# EAGLE design speedy_gonzalez (EAGLE 9.6.2)
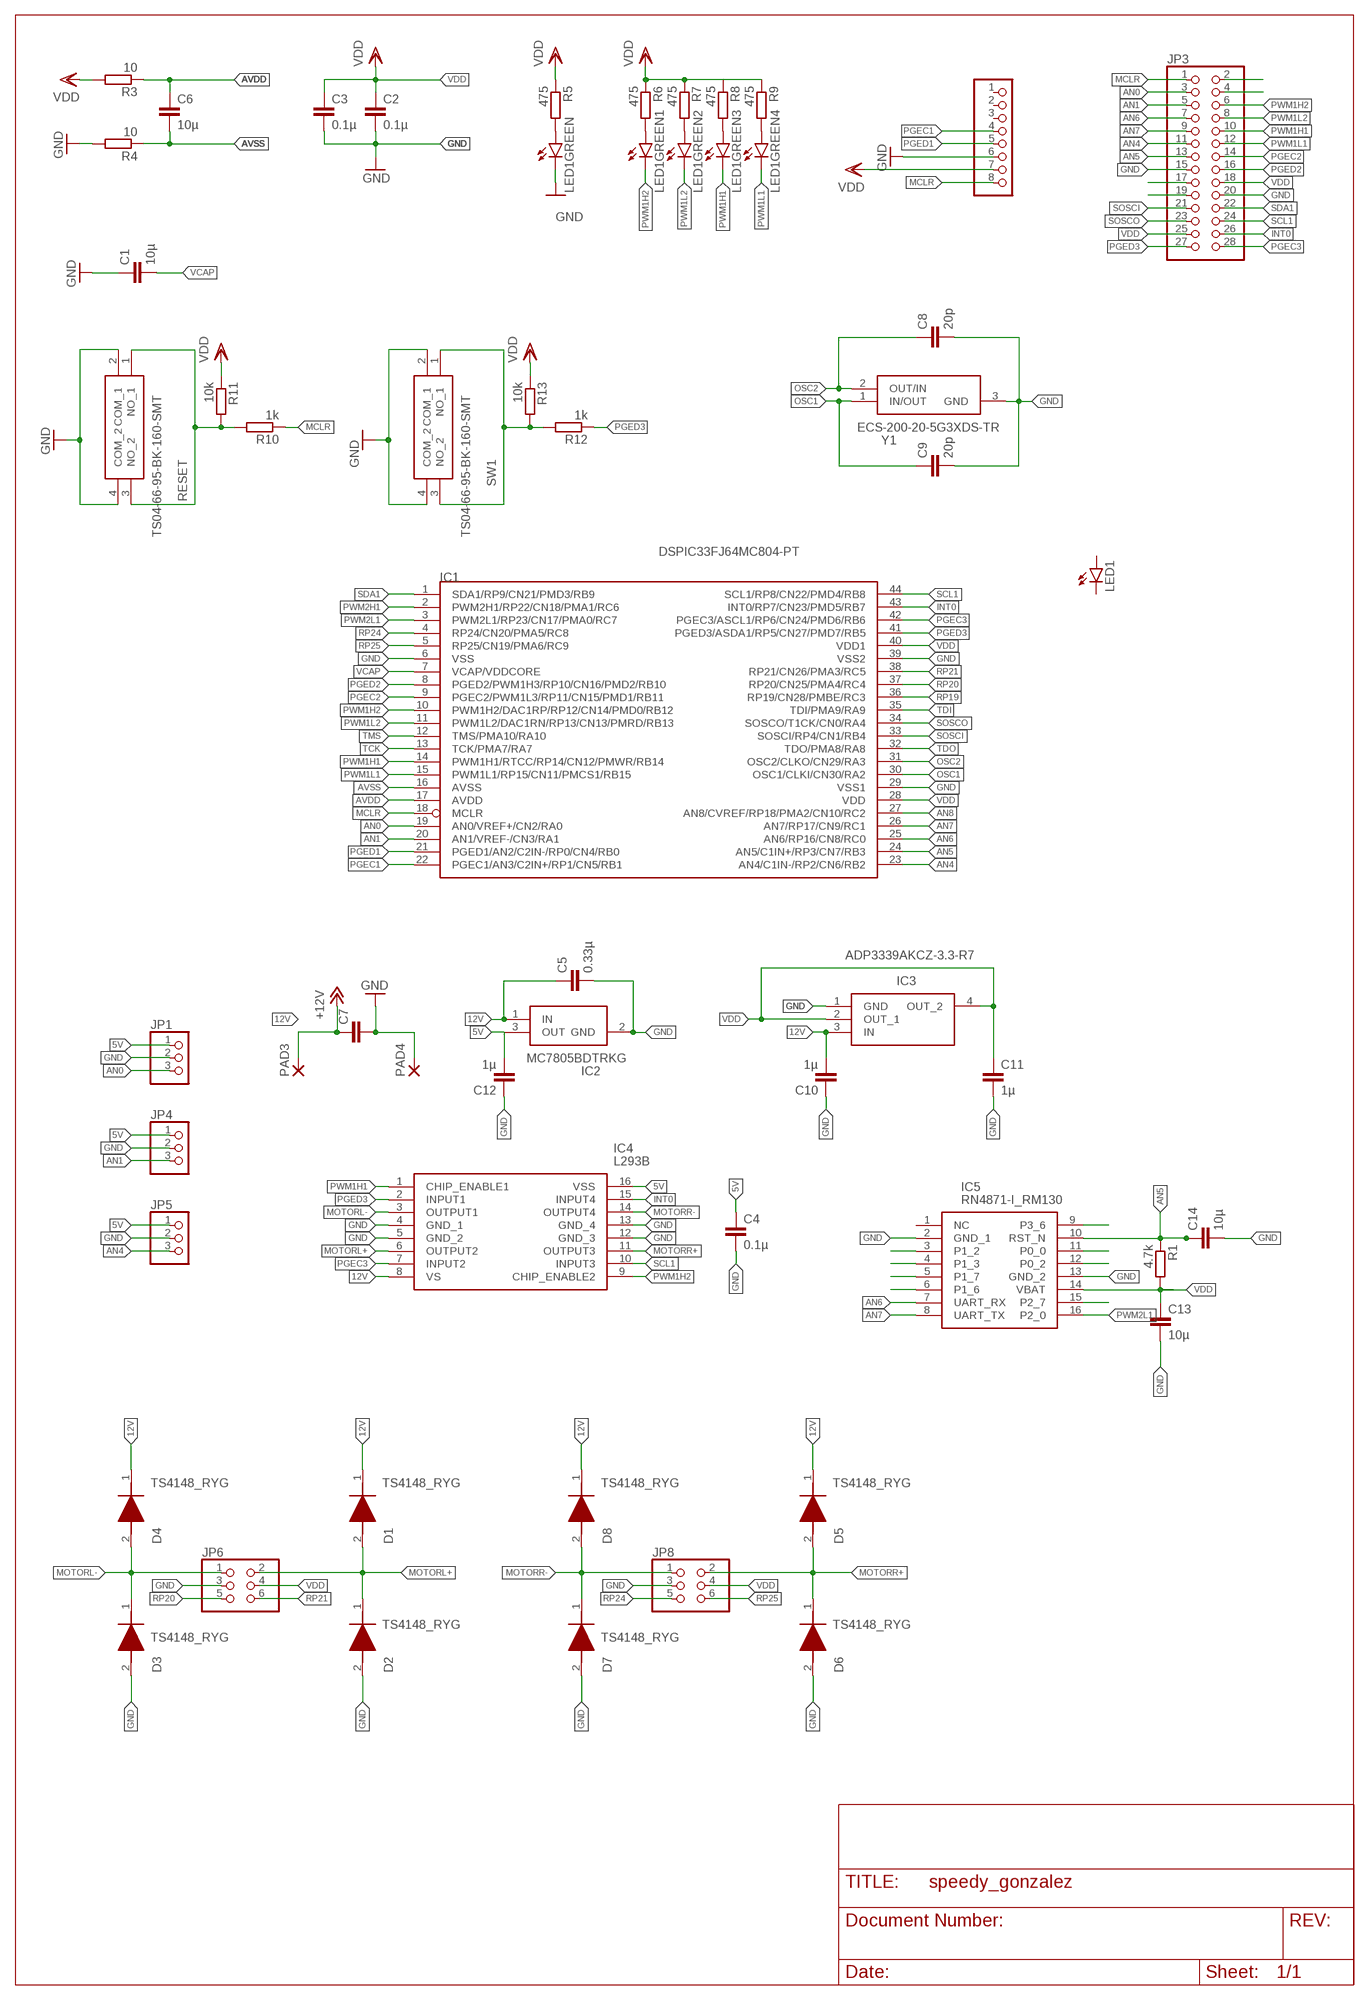
[diagram p0: schematic, sheet 1]

## Parts
C1  10µ  C-EUC0805  [C0805]
C2  0.1µ  C-EUC0805  [C0805]
C3  0.1µ  C-EUC0805  [C0805]
C4  0.1µ  C-EUC0805  [C0805]
C5  0.33µ  C-EUC0805  [C0805]
C6  10µ  C-EUC0805  [C0805]
C7  C-EU050-055X075  [C050-055X075]
C8  20p  C-EUC0805  [C0805]
C9  20p  C-EUC0805  [C0805]
C10  1µ  C-EUC0805  [C0805]
C11  1µ  C-EUC0805  [C0805]
C12  1µ  C-EUC0805  [C0805]
C13  10µ  C-EUC0805  [C0805]
C14  10µ  C-EUC0805  [C0805]
D1  TS4148_RYG  [DIOC2012X85N]
D2  TS4148_RYG  [DIOC2012X85N]
D3  TS4148_RYG  [DIOC2012X85N]
D4  TS4148_RYG  [DIOC2012X85N]
D5  TS4148_RYG  [DIOC2012X85N]
D6  TS4148_RYG  [DIOC2012X85N]
D7  TS4148_RYG  [DIOC2012X85N]
D8  TS4148_RYG  [DIOC2012X85N]
IC1  DSPIC33FJ64MC804-PT  [TQFP44]
IC2  MC7805BDTRKG  [LM317MADTRKG]
IC3  ADP3339AKCZ-3.3-R7  [SOT230P700X180-4N]
IC4  L293B  [DIP850W50P254L2000H510Q16N]
IC5  RN4871-I_RM130  [RN4871]
JP1  PINHD-1X3  [1X03]
JP2  PINHD-1X8  [1X08]
JP3  PINHD-2X14  [2X14]
JP4  PINHD-1X3  [1X03]
JP5  PINHD-1X3  [1X03]
JP6  PINHD-2X3  [2X03]
JP8  PINHD-2X3  [2X03]
LED1  LED5MM  [LED5MM]
LED1GREEN  LEDCHIPLED_0805  [CHIPLED_0805]
LED1GREEN1  LEDCHIPLED_0805  [CHIPLED_0805]
LED1GREEN2  LEDCHIPLED_0805  [CHIPLED_0805]
LED1GREEN3  LEDCHIPLED_0805  [CHIPLED_0805]
LED1GREEN4  LEDCHIPLED_0805  [CHIPLED_0805]
PAD3  2,15/1,0  [2,15/1,0]
PAD4  2,15/1,0  [2,15/1,0]
R1  4.7k  R-EU_R0805  [R0805]
R3  10  R-EU_R0805  [R0805]
R4  10  R-EU_R0805  [R0805]
R5  475  R-EU_R0805  [R0805]
R6  475  R-EU_R0805  [R0805]
R7  475  R-EU_R0805  [R0805]
R8  475  R-EU_R0805  [R0805]
R9  475  R-EU_R0805  [R0805]
R10  1k  R-EU_R0805  [R0805]
R11  10k  R-EU_R0805  [R0805]
R12  1k  R-EU_R0805  [R0805]
R13  10k  R-EU_R0805  [R0805]
RESET  TS04-66-95-BK-160-SMT  [TS046695BK160SMT]
SW1  TS04-66-95-BK-160-SMT  [TS046695BK160SMT]
Y1  ECS-200-20-5G3XDS-TR  [ECS250205G3XDSFTR]

## Nets
5V: C4.1 C12.2 IC2.3(OUT) IC4.16(VSS) JP1.1 JP4.1 JP5.1
12V: C5.1 C7.1 C10.2 D1.1(K) D4.1(K) D5.1(K) D8.1(K) IC2.1(IN) IC3.3(IN) IC4.8(VS) PAD3.1(P) ; supply symbol labelled +12V
AN0: IC1.19(AN0/VREF+/CN2/RA0) JP1.3 JP3.3
AN1: IC1.20(AN1/VREF-/CN3/RA1) JP3.5 JP4.3
AN4: IC1.23(AN4/C1IN-/RP2/CN6/RB2) JP3.11 JP5.3
AN5: C14.1 IC1.24(AN5/C1IN+/RP3/CN7/RB3) IC5.10(RST_N) JP3.13 R1.1
AN6: IC1.25(AN6/RP16/CN8/RC0) IC5.7(UART_RX) JP3.7
AN7: IC1.26(AN7/RP17/CN9/RC1) IC5.8(UART_TX) JP3.9
AN8: IC1.27(AN8/CVREF/RP18/PMA2/CN10/RC2)
AVDD: C6.1 IC1.17(AVDD) R3.1
AVSS: C6.2 IC1.16(AVSS) R4.1
GND: C1.1 C2.2 C3.2 C4.2 C5.2 C7.2 C8.2 C9.2 C10.1 C11.2 C12.1 C13.2 C14.2 D2.2(A) D3.2(A) D6.2(A) D7.2(A) IC1.6(VSS) IC1.29(VSS1) IC1.39(VSS2) IC2.2(GND) IC3.1(GND) IC4.4(GND_1) IC4.5(GND_2) IC4.12(GND_3) IC4.13(GND_4) IC5.2(GND_1) IC5.13(GND_2) JP1.2 JP2.6 JP3.15 JP3.20 JP4.2 JP5.2 JP6.3 JP8.3 LED1GREEN.C PAD4.1(P) R4.2 RESET.2(COM_1) RESET.4(COM_2) SW1.2(COM_1) SW1.4(COM_2) Y1.3(GND)
INT0: IC1.43(INT0/RP7/CN23/PMD5/RB7) IC4.15(INPUT4) JP3.26
MCLR: IC1.18(MCLR) JP2.8 JP3.1 R10.1
MOTORL+: D1.2(A) D2.1(K) IC4.6(OUTPUT2) JP6.2
MOTORL-: D3.1(K) D4.2(A) IC4.3(OUTPUT1) JP6.1
MOTORR+: D5.2(A) D6.1(K) IC4.11(OUTPUT3) JP8.2
MOTORR-: D7.1(K) D8.2(A) IC4.14(OUTPUT4) JP8.1
N$1: LED1GREEN.A R5.2
N$2: LED1GREEN1.A R6.2
N$3: LED1GREEN2.A R7.2
N$6: LED1GREEN3.A R8.2
N$7: R12.2 R13.2 SW1.1(NO_1) SW1.3(NO_2)
N$8: R10.2 R11.2 RESET.1(NO_1) RESET.3(NO_2)
N$10: LED1GREEN4.A R9.2
N$12: IC5.3(P1_2)
N$13: IC5.4(P1_3)
N$14: IC5.5(P1_7)
N$15: IC5.6(P1_6)
N$18: JP3.17
N$19: JP3.19
N$20: IC5.9(P3_6)
N$22: IC5.11(P0_0)
N$23: IC5.12(P0_2)
N$24: JP3.2
N$25: JP3.4
N$28: IC5.15(P2_7)
OSC1: C9.1 IC1.30(OSC1/CLKI/CN30/RA2) Y1.1(IN/OUT)
OSC2: C8.1 IC1.31(OSC2/CLKO/CN29/RA3) Y1.2(OUT/IN)
PGEC1: IC1.22(PGEC1/AN3/C2IN+/RP1/CN5/RB1) JP2.4
PGEC2: IC1.9(PGEC2/PWM1L3/RP11/CN15/PMD1/RB11) JP3.14
PGEC3: IC1.42(PGEC3/ASCL1/RP6/CN24/PMD6/RB6) IC4.7(INPUT2) JP3.28
PGED1: IC1.21(PGED1/AN2/C2IN-/RP0/CN4/RB0) JP2.5
PGED2: IC1.8(PGED2/PWM1H3/RP10/CN16/PMD2/RB10) JP3.16
PGED3: IC1.41(PGED3/ASDA1/RP5/CN27/PMD7/RB5) IC4.2(INPUT1) JP3.27 R12.1
PWM1H1: IC1.14(PWM1H1/RTCC/RP14/CN12/PMWR/RB14) IC4.1(CHIP_ENABLE1) JP3.10 LED1GREEN3.C
PWM1H2: IC1.10(PWM1H2/DAC1RP/RP12/CN14/PMD0/RB12) IC4.9(CHIP_ENABLE2) JP3.6 LED1GREEN1.C
PWM1L1: IC1.15(PWM1L1/RP15/CN11/PMCS1/RB15) JP3.12 LED1GREEN4.C
PWM1L2: IC1.11(PWM1L2/DAC1RN/RP13/CN13/PMRD/RB13) JP3.8 LED1GREEN2.C
PWM2H1: IC1.2(PWM2H1/RP22/CN18/PMA1/RC6)
PWM2L1: IC1.3(PWM2L1/RP23/CN17/PMA0/RC7) IC5.16(P2_0)
RP19: IC1.36(RP19/CN28/PMBE/RC3)
RP20: IC1.37(RP20/CN25/PMA4/RC4) JP6.5
RP21: IC1.38(RP21/CN26/PMA3/RC5) JP6.6
RP24: IC1.4(RP24/CN20/PMA5/RC8) JP8.5
RP25: IC1.5(RP25/CN19/PMA6/RC9) JP8.6
SCL1: IC1.44(SCL1/RP8/CN22/PMD4/RB8) IC4.10(INPUT3) JP3.24
SDA1: IC1.1(SDA1/RP9/CN21/PMD3/RB9) JP3.22
SOSCI: IC1.33(SOSCI/RP4/CN1/RB4) JP3.21
SOSCO: IC1.34(SOSCO/T1CK/CN0/RA4) JP3.23
TCK: IC1.13(TCK/PMA7/RA7)
TDI: IC1.35(TDI/PMA9/RA9)
TDO: IC1.32(TDO/PMA8/RA8)
TMS: IC1.12(TMS/PMA10/RA10)
VCAP: C1.2 IC1.7(VCAP/VDDCORE)
VDD: C2.1 C3.1 C11.1 C13.1 IC1.28(VDD) IC1.40(VDD1) IC3.2(OUT_1) IC3.4(OUT_2) IC5.14(VBAT) JP2.7 JP3.18 JP3.25 JP6.4 JP8.4 R1.2 R3.2 R5.1 R6.1 R7.1 R8.1 R9.1 R11.1 R13.1
Unconnected: IC5.1(NC) JP2.1 JP2.2 JP2.3 LED1.A LED1.K(C)

## Library data of the parts
C1-C14 = rcl:C-EU: CAPACITOR, European symbol; SPICEPREFIX: C
D1-D8 = SamacSys_Parts:TS4148_RYG: TAIWAN SEMICONDUCTOR - TS4148 RYG - DIODE, SMALL SIGNAL, 75V, 0.15A, 0805 Source: Datasheet <https://componentsearchengine.com/Datasheets/2/TS4148 RYG.pdf>; DESCRIPTION: TAIWAN SEMICONDUCTOR - TS4148 RYG - DIODE, SMALL SIGNAL, 75V, 0.15A, 0805; HEIGHT: 0.85mm; MANUFACTURER_NAME: Taiwan Semiconductor; MANUFACTURER_PART_NUMBER: TS4148 RYG; MOUSER_PART_NUMBER: 821-TS4148RYG; MOUSER_PRICE-STOCK: https://www.mouser.co.uk/ProductDetail/Taiwan-Semiconductor/TS4148-RYG?qs=C%2F0tY%2F%2FqZe%2Fr0HVt0T5xsg%3D%3D
IC1 = microchip-dspic33fjxxmc:DSPIC33FJ64MC804: dsPIC33FJ32MC302/304, dsPIC33FJ64MCX02/X04, AND dsPIC33FJ128MCX02/X04 High-Performance, 16-bit Digital Signal Controllers Package:44 Pin TQFP Operating Range: * Up to 40 MIPS operation (at 3.0V -3.6V): - Industrial temperature range (-40°C to +85°C) - Extended temperature range (-40°C to +125°C) High-Performance DSC CPU: * Modified Harvard architecture * C compiler optimized instruction set * 16-bit wide data path * 24-bit wide instructions * Linear program memory addressing up to 4M instruction words * Linear data memory addressing up to 64 Kbytes * 83 base instructions: mostly 1 word/1 cycle * Two 40-bit accumulators with rounding and saturation options * Flexible and powerful addressing modes: - Indirect - Modulo - Bit-Reversed * Software stack * 16 x 16 fractional/integer multiply operations * 32/16 and 16/16 divide operations * Single-cycle multiply and accumulate: - Accumulator write back for DSP operations - Dual data fetch * Up to ±16-bit shifts for up to 40-bit data Direct Memory Access (DMA): * 8-channel hardware DMA * Up to 2 Kbytes dual ported DMA buffer area (DMA RAM) to store data transferred via DMA: - Allows data transfer between RAM and a peripheral while CPU is executing code (no cycle stealing) * Most peripherals support DMA Timers/Capture/Compare/PWM: * Timer/Counters, up to five 16-bit timers: - Can pair up to make two 32-bit timers - One timer runs as a Real-Time Clock with an external 32.768 kHz oscillator - Programmable prescaler * Input Capture (up to four channels): - Capture on up, down or both edges - 16-bit capture input functions - 4-deep FIFO on each capture * Output Compare (up to four channels): - Single or Dual 16-bit Compare mode - 16-bit Glitchless PWM mode * Hardware Real-Time Clock/Calendar (RTCC): - Provides clock, calendar, and alarm functions Interrupt Controller: * 5-cycle latency * Up to 53 available interrupt sources * Up to three external interrupts * Seven programmable priority levels * Five processor exceptions Digital I/O: * Peripheral pin Select functionality * Up to 35 programmable digital I/O pins * Wake-up/Interrupt-on-Change for up to 31 pins * Output pins can drive from 3.0V to 3.6V * Up to 5V output with open drain configuration * All digital input pins are 5V tolerant * 4 mA sink on all I/O pins On-Chip Flash and SRAM: * Flash program memory (up to 128 Kbytes) * Data SRAM (up to 16 Kbytes) * Boot, Secure, and General Security for program Flash System Management: * Flexible clock options: - External, crystal, resonator, internal RC - Fully integrated Phase-Locked Loop (PLL) - Extremely low jitter PLL * Power-up Timer * Oscillator Start-up Timer/Stabilizer * Watchdog Timer with its own RC oscillator * Fail-Safe Clock Monitor * Reset by multiple sources Power Management: * On-chip 2.5V voltage regulator * Switch between clock sources in real time * Idle, Sleep, and Doze modes with fast wake-up Analog-to-Digital Converters (ADCs): * 10-bit, 1.1 Msps or 12-bit, 500 Ksps conversion: - Two and four simultaneous samples (10-bit ADC) - Up to nine input channels with auto-scanning - Conversion start can be manual or synchronized with one of four trigger sources - Conversion possible in Sleep mode - ±2 LSb max integral nonlinearity - ±1 LSb max differential nonlinearity Audio Digital-to-Analog Converter (DAC): - 16-bit Dual Channel DAC module - 100 Ksps maximum sampling rate - Second-Order Digital Delta-Sigma Modulator Comparator Module: * Two analog comparators with programmable input/output configuration CMOS Flash Technology: * Low-power, high-speed Flash technology * Fully static design * 3.3V (±10%) operating voltage * Industrial and Extended temperature * Low power consumption Motor Control Peripherals: * 6-channel 16-bit Motor Control PWM: - Three duty cycle generators - Independent or Complementary mode - Programmable dead-time and output polarity - Edge-aligned or center-aligned - Manual output override control - One Fault input - Trigger for ADC conversions - PWM frequency for 16-bit resolution (@ 40 MIPS) = 1220 Hz for Edge-Aligned mode, 610 Hz for Center-Aligned mode - PWM frequency for 11-bit resolution (@ 40 MIPS) = 39.1 kHz for Edge-Aligned mode, 19.55 kHz for Center-Aligned mode * 2-channel 16-bit Motor Control PWM: - One duty cycle generator - Independent or Complementary mode - Programmable dead time and output polarity - Edge-aligned or center-aligned - Manual output override control - One Fault input - Trigger for ADC conversions - PWM frequency for 16-bit resolution (@ 40 MIPS) = 1220 Hz for Edge-Aligned mode, 610 Hz for Center-Aligned mode - PWM frequency for 11-bit resolution (@ 40 MIPS) = 39.1 kHz for Edge-Aligned mode, 19.55 kHz for Center-Aligned mode * 2-Quadrature Encoder Interface module: - Phase A, Phase B, and index pulse input - 16-bit up/down position counter - Count direction status - Position Measurement (x2 and x4) mode - Programmable digital noise filters on inputs - Alternate 16-bit Timer/Counter mode - Interrupt on position counter rollover/underflow
IC2 = SamacSys_Parts:MC7805BDTRKG: Linear Voltage Regulators 5V 1A Positive Source: Datasheet <https://componentsearchengine.com/Datasheets/2/MC7805BDTRKG.pdf>; DESCRIPTION: Linear Voltage Regulators 5V 1A Positive; HEIGHT: 2.38mm; MANUFACTURER_NAME: onsemi; MANUFACTURER_PART_NUMBER: MC7805BDTRKG; MOUSER_PART_NUMBER: 863-MC7805BDTRKG; MOUSER_PRICE-STOCK: https://www.mouser.co.uk/ProductDetail/onsemi/MC7805BDTRKG?qs=%252B9%2Fcbd0IE0RVSCV5SBH6%2FA%3D%3D
IC3 = SamacSys_Parts:ADP3339AKCZ-3.3-R7: ADP3339AKCZ-3.3-R7, Low Dropout Voltage Regulator, 1.5A, 3.3 V +/-0.9%, 2.8 6 Vin, 4-Pin SOT-223 Source: Datasheet <http://www.analog.com/static/imported-files/data_sheets/ADP3339.pdf>; DESCRIPTION: ADP3339AKCZ-3.3-R7, Low Dropout Voltage Regulator, 1.5A, 3.3 V +/-0.9%, 2.8 6 Vin, 4-Pin SOT-223; HEIGHT: 1.8mm; MANUFACTURER_NAME: Analog Devices; MANUFACTURER_PART_NUMBER: ADP3339AKCZ-3.3-R7; MOUSER_PART_NUMBER: 584-ADP3339AKCZ3.3R7; MOUSER_PRICE-STOCK: https://www.mouser.co.uk/ProductDetail/Analog-Devices/ADP3339AKCZ-3.3-R7?qs=WIvQP4zGanhoxUECVzDnsA%3D%3D
IC4 = SamacSys_Parts:L293B: L293B, Motor Driver, 4.5 36 V, 16-Pin PDIP Source: Datasheet <http://www.st.com/web/en/resource/technical/document/datasheet/CD00000058.pdf>; DESCRIPTION: L293B, Motor Driver, 4.5 36 V, 16-Pin PDIP; HEIGHT: 5.1mm; MANUFACTURER_NAME: STMicroelectronics; MANUFACTURER_PART_NUMBER: L293B; MOUSER_PART_NUMBER: 511-L293B; MOUSER_PRICE-STOCK: https://www.mouser.co.uk/ProductDetail/STMicroelectronics/L293B?qs=gr8Zi5OG3Mhln2B1GrZirA%3D%3D
IC5 = SamacSys_Parts:RN4871-I_RM130: Bluetooth BLE Module, Shielded, Antenna, Source: Datasheet <http://ww1.microchip.com/downloads/en/DeviceDoc/50002489C.pdf>; DESCRIPTION: Bluetooth BLE Module, Shielded, Antenna,; HEIGHT: mm; MANUFACTURER_NAME: Microchip; MANUFACTURER_PART_NUMBER: RN4871-I/RM130; MOUSER_PART_NUMBER: 579-RN4871IRM130; MOUSER_PRICE-STOCK: https://www.mouser.co.uk/ProductDetail/Microchip-Technology/RN4871-I-RM130?qs=MLItCLRbWswoZsrzvVbGYw%3D%3D
JP1 JP4 JP5 = pinhead:PINHD-1X3: PIN HEADER
JP2 = pinhead:PINHD-1X8: PIN HEADER
JP3 = pinhead:PINHD-2X14: PIN HEADER
JP6 JP8 = pinhead:PINHD-2X3: PIN HEADER
LED1 LED1GREEN LED1GREEN1-LED1GREEN4 = led:LED: LED OSRAM: - CHIPLED LG R971, LG N971, LY N971, LG Q971, LY Q971, LO R971, LY R971 LH N974, LH R974 LS Q976, LO Q976, LY Q976 LO Q996 - Hyper CHIPLED LW Q18S LB Q993, LB Q99A, LB R99A - SideLED LS A670, LO A670, LY A670, LG A670, LP A670 LB A673, LV A673, LT A673, LW A673 LH A674 LY A675 LS A676, LA A676, LO A676, LY A676, LW A676 LS A679, LY A679, LG A679 - Hyper Micro SIDELED® LS Y876, LA Y876, LO Y876, LY Y876 LT Y87S - SmartLED LW L88C, LW L88S LB L89C, LB L89S, LG L890 LS L89K, LO L89K, LY L89K LS L896, LA L896, LO L896, LY L896 - TOPLED LS T670, LO T670, LY T670, LG T670, LP T670 LSG T670, LSP T670, LSY T670, LOP T670, LYG T670 LG T671, LOG T671, LSG T671 LB T673, LV T673, LT T673, LW T673 LH T674 LS T676, LA T676, LO T676, LY T676, LB T676, LH T676, LSB T676, LW T676 LB T67C, LV T67C, LT T67C, LS T67K, LO T67K, LY T67K, LW E67C LS E67B, LA E67B, LO E67B, LY E67B, LB E67C, LV E67C, LT E67C LW T67C LS T679, LY T679, LG T679 LS T770, LO T770, LY T770, LG T770, LP T770 LB T773, LV T773, LT T773, LW T773 LH T774 LS E675, LA E675, LY E675, LS T675 LS T776, LA T776, LO T776, LY T776, LB T776 LHGB T686 LT T68C, LB T68C - Hyper Mini TOPLED® LB M676 - Mini TOPLED Santana® LG M470 LS M47K, LO M47K, LY M47K Source: http://www.osram.convergy.de LUXEON: - LUMILED® LXK2-PW12-R00, LXK2-PW12-S00, LXK2-PW14-U00, LXK2-PW14-V00 LXK2-PM12-R00, LXK2-PM12-S00, LXK2-PM14-U00 LXK2-PE12-Q00, LXK2-PE12-R00, LXK2-PE12-S00, LXK2-PE14-T00, LXK2-PE14-U00 LXK2-PB12-K00, LXK2-PB12-L00, LXK2-PB12-M00, LXK2-PB14-N00, LXK2-PB14-P00, LXK2-PB14-Q00 LXK2-PR12-L00, LXK2-PR12-M00, LXK2-PR14-Q00, LXK2-PR14-R00 LXK2-PD12-Q00, LXK2-PD12-R00, LXK2-PD12-S00 LXK2-PH12-R00, LXK2-PH12-S00 LXK2-PL12-P00, LXK2-PL12-Q00, LXK2-PL12-R00 Source: www.luxeon.com KINGBRIGHT: KA-3528ASYC Source: www.kingbright.com
PAD3 PAD4 = wirepad:2,15/1,0: THROUGH-HOLE PAD
R1 R3-R13 = rcl:R-EU_: RESISTOR, European symbol; SPICEPREFIX: R
RESET SW1 = SamacSys_Parts:TS04-66-95-BK-160-SMT: Switch Tactile OFF (ON) SPST Round Button Gull Wing 0.05A 12VDC 80000Cycles 1.6N SMD Bag Source: Datasheet <https://www.arrow.com/en/products/ts04-66-95-bk-160-smt/cui-devices?region=nac>; DESCRIPTION: Switch Tactile OFF (ON) SPST Round Button Gull Wing 0.05A 12VDC 80000Cycles 1.6N SMD Bag; HEIGHT: 9.6mm; MANUFACTURER_NAME: CUI Inc.; MANUFACTURER_PART_NUMBER: TS04-66-95-BK-160-SMT
Y1 = SamacSys_Parts:ECS-200-20-5G3XDS-TR: Crystals 20.0Mhz 100ppm -40c +125C 20pF Source: Datasheet <https://ecsxtal.com/store/pdf/csm_7x_3l.pdf>; DESCRIPTION: Crystals 20.0Mhz 100ppm -40c +125C 20pF; HEIGHT: 4.2mm; MANUFACTURER_NAME: ECS; MANUFACTURER_PART_NUMBER: ECS-200-20-5G3XDS-TR; MOUSER_PART_NUMBER: 520-ECS-200-20-5GXT; MOUSER_PRICE-STOCK: https://www.mouser.co.uk/ProductDetail/ECS/ECS-200-20-5G3XDS-TR?qs=aTQdX%252BfNGTocHFG2VN%252Birg%3D%3D

## Board
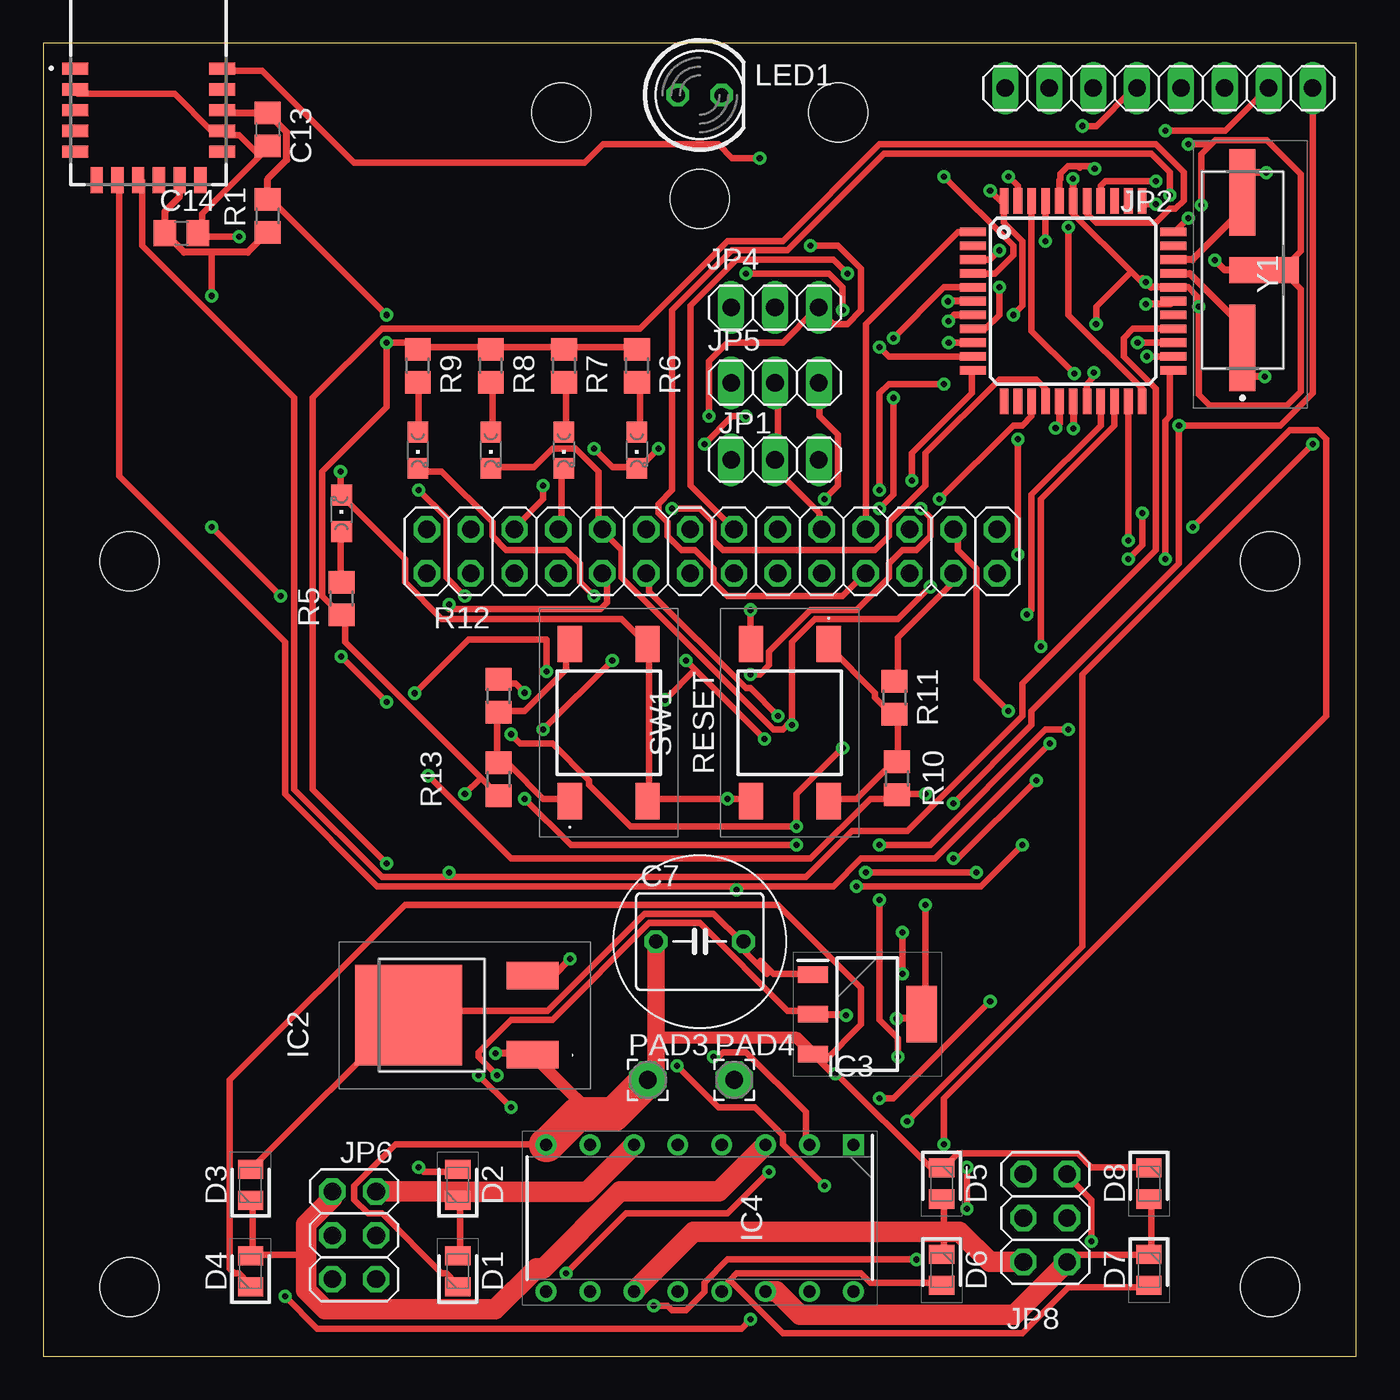
[diagram p1: board, top side]
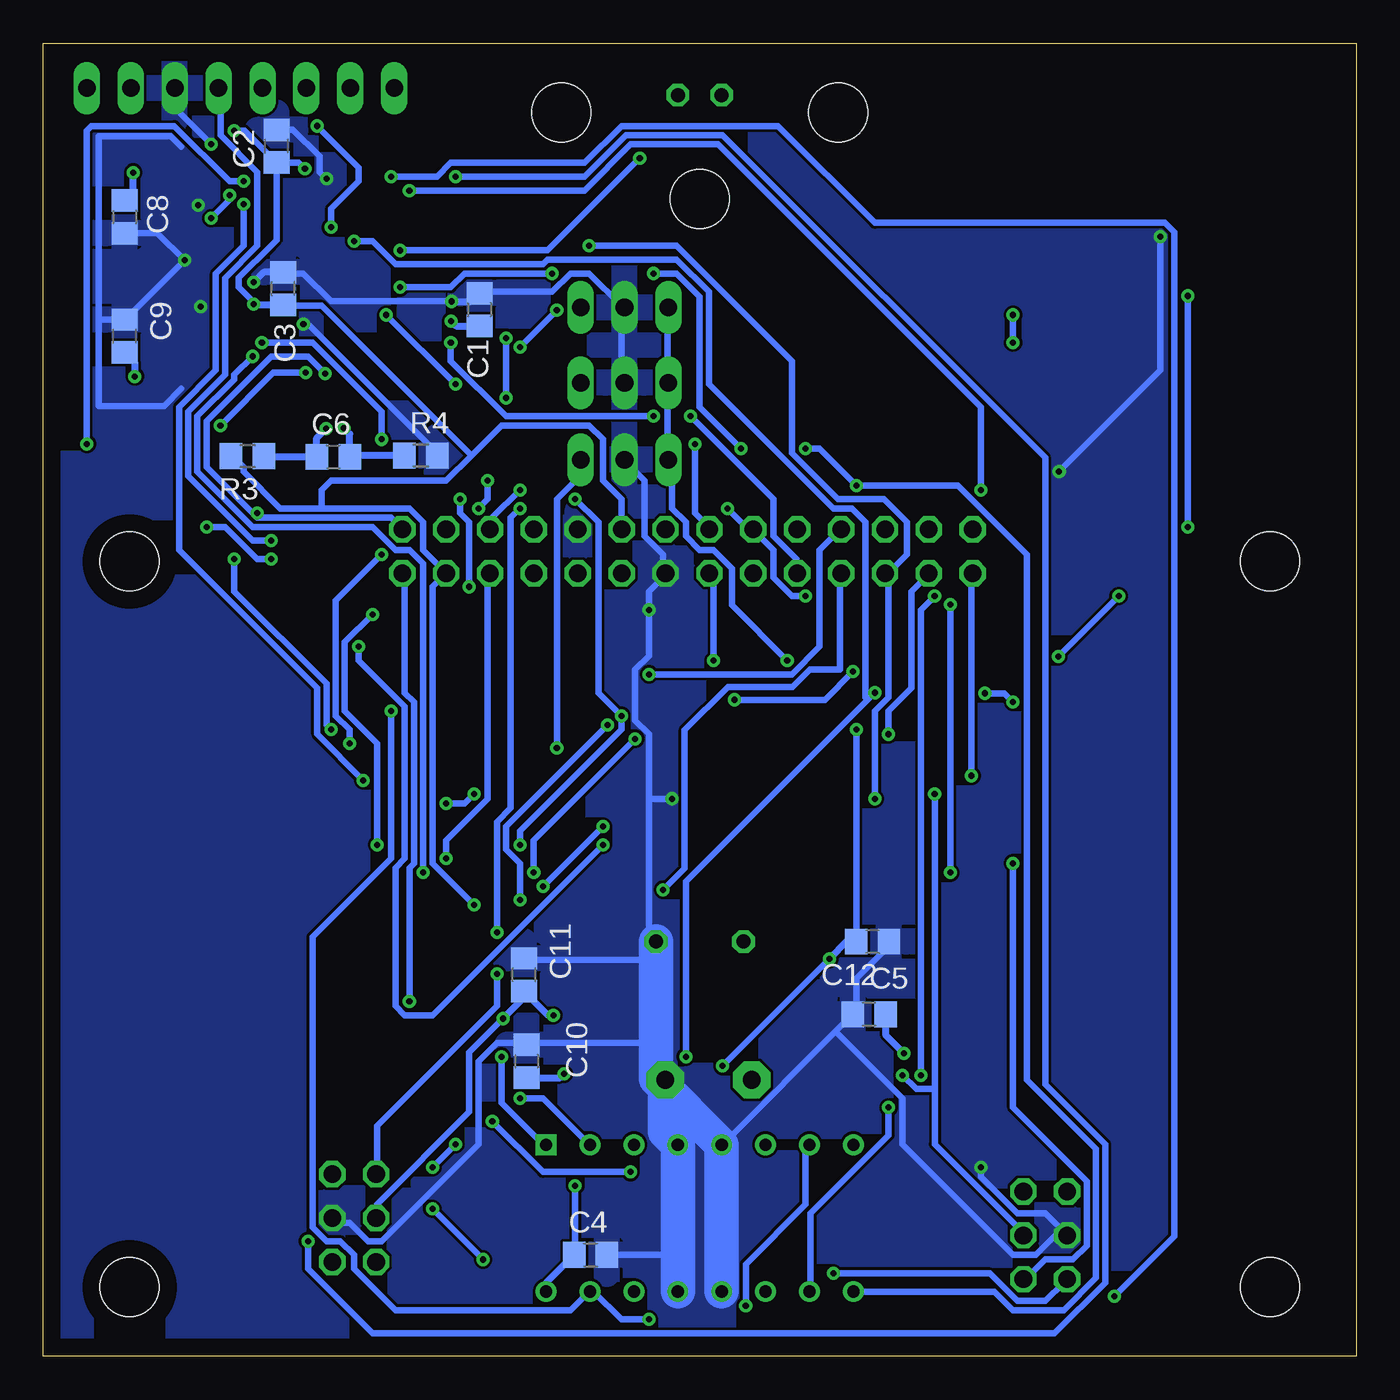
[diagram p2: board, bottom side, seen from below]

Size 76 x 76 mm. Coordinates in mm from the lower left corner, seen from the top.
Outline: 0,0 76,0 76,76 0,76 0,0
Copper layers (1*16): Top 0.035mm / dielectric 1.5mm / Bottom 0.035mm
Design rules "default *": minimum track width 15mil, minimum drill 0.35mm, track to track 6mil, track to pad 6mil, pad to pad 6mil, via to via 6mil, smd to smd 6mil, copper to edge 40mil, drill to drill 6mil, minimum pad ring 10mil, minimum via ring 8mil, stop-mask expansion 4mil, vias tented up to drill 0mil, thermal gap 10mil
Holes 3.4 mm at 5,46 5,4 71,46 71,4 30,72 46,72 38,67

### Footprints (pad centres in the part's own frame; a part is rotated, then mirrored left to right if it is on the bottom)
C0805 = smd 1.3 x 1.5: 1 -0.95,0; 2 0.95,0
C050-055X075 = drill 0.813 octagon: 1 -2.54,0; 2 2.54,0
DIOC2012X85N = smd 1.1 x 1.45: 1 -0.9,0; 2 0.9,0
TQFP44 = smd 1.5 x 0.5: 1 -5.8,4; 2 -5.8,3.2; 3 -5.8,2.4; 4 -5.8,1.6; 5 -5.8,0.8; 6 -5.8,0; 7 -5.8,-0.8; 8 -5.8,-1.6; 9 -5.8,-2.4; 10 -5.8,-3.2; 11 -5.8,-4; 23 5.8,-4; 24 5.8,-3.2; 25 5.8,-2.4; 26 5.8,-1.6; 27 5.8,-0.8; 28 5.8,0; 29 5.8,0.8; 30 5.8,1.6; 31 5.8,2.4; 32 5.8,3.2; 33 5.8,4 | smd 0.5 x 1.5: 12 -4,-5.8; 13 -3.2,-5.8; 14 -2.4,-5.8; 15 -1.6,-5.8; 16 -0.8,-5.8; 17 0,-5.8; 18 0.8,-5.8; 19 1.6,-5.8; 20 2.4,-5.8; 21 3.2,-5.8; 22 4,-5.8; 34 4,5.8; 35 3.2,5.8; 36 2.4,5.8; 37 1.6,5.8; 38 0.8,5.8; 39 0,5.8; 40 -0.8,5.8; 41 -1.6,5.8; 42 -2.4,5.8; 43 -3.2,5.8; 44 -4,5.8
LM317MADTRKG = smd 3 x 1.6: 1 4.08,-2.285; 3 4.08,2.285 | smd 6.2 x 5.8: 2 -3.1,0
SOT230P700X180-4N = smd 1.75 x 0.95: 1 -3.15,2.3; 2 -3.15,0; 3 -3.15,-2.3 | smd 1.75 x 3.25: 4 3.15,0
DIP850W50P254L2000H510Q16N = drill 0.7 pad 1.1 square: 1 -4.25,8.89 | drill 0.7 pad 1.1: 2 -4.25,6.35; 3 -4.25,3.81; 4 -4.25,1.27; 5 -4.25,-1.27; 6 -4.25,-3.81; 7 -4.25,-6.35; 8 -4.25,-8.89; 9 4.25,-8.89; 10 4.25,-6.35; 11 4.25,-3.81; 12 4.25,-1.27; 13 4.25,1.27; 14 4.25,3.81; 15 4.25,6.35; 16 4.25,8.89
RN4871 = smd 1.5 x 0.7: 1 -4.25,6.7; 2 -4.25,5.5; 3 -4.25,4.3; 4 -4.25,3.1; 5 -4.25,1.9; 12 4.25,1.9; 13 4.25,3.1; 14 4.25,4.3; 15 4.25,5.5; 16 4.25,6.7 | smd 0.7 x 1.5: 6 -3,0.25; 7 -1.8,0.25; 8 -0.6,0.25; 9 0.6,0.25; 10 1.8,0.25; 11 3,0.25
1X03 = drill 1.016 long: 1 -2.54,0; 2 0,0; 3 2.54,0
1X08 = drill 1.016 long: 1 -8.89,0; 2 -6.35,0; 3 -3.81,0; 4 -1.27,0; 5 1.27,0; 6 3.81,0; 7 6.35,0; 8 8.89,0
2X14 = drill 1.016 octagon: 1 -16.51,-1.27; 2 -16.51,1.27; 3 -13.97,-1.27; 4 -13.97,1.27; 5 -11.43,-1.27; 6 -11.43,1.27; 7 -8.89,-1.27; 8 -8.89,1.27; 9 -6.35,-1.27; 10 -6.35,1.27; 11 -3.81,-1.27; 12 -3.81,1.27; 13 -1.27,-1.27; 14 -1.27,1.27; 15 1.27,-1.27; 16 1.27,1.27; 17 3.81,-1.27; 18 3.81,1.27; 19 6.35,-1.27; 20 6.35,1.27; 21 8.89,-1.27; 22 8.89,1.27; 23 11.43,-1.27; 24 11.43,1.27; 25 13.97,-1.27; 26 13.97,1.27; 27 16.51,-1.27; 28 16.51,1.27
2X03 = drill 1.016 octagon: 1 -2.54,-1.27; 2 -2.54,1.27; 3 0,-1.27; 4 0,1.27; 5 2.54,-1.27; 6 2.54,1.27
LED5MM = drill 0.813 octagon: A -1.27,0; K 1.27,0
CHIPLED_0805 = smd 1.2 x 1.2: A 0,-1.05; C 0,1.05
2,15/1,0 = drill 1.016 pad 2.159 octagon: 1 0,0
R0805 = smd 1.3 x 1.5: 1 -0.95,0; 2 0.95,0
TS046695BK160SMT = smd 2.1 x 1.4: 1 -4.55,2.25; 2 -4.55,-2.25; 3 4.55,2.25; 4 4.55,-2.25
ECS250205G3XDSFTR = smd 5 x 1.5: 1 -4.5,0; 2 4.5,0 | smd 1.5 x 4: 3 0,-1.25

### Placement (x,y rotation side)
C1  50.75,60.58 270 bottom
C2  62.5,70.04 90 bottom
C3  62.11,61.79 90 bottom
C4  44.32,5.87 0 bottom
C5  28.2,19.8 180 bottom
C6  59.21,52.06 0 bottom
C7  38,24 0 top
C8  71.29,65.95 270 bottom
C9  71.29,59.05 90 bottom
C10  48.03,17.08 270 bottom
C11  48.17,22.08 90 bottom
C12  28,24 180 bottom
C13  13,71 270 top
C14  8,65 0 top
D1  24,4.93 90 top
D2  24,9.93 90 top
D3  12,9.93 90 top
D4  12,4.93 90 top
D5  52,10 270 top
D6  52,5 270 top
D7  64,5 270 top
D8  64,10 270 top
IC1  59.61,61.07 0 top
IC2  24.24,19.74 0 top
IC3  47.7,19.8 0 top
IC4  38,8 270 top
IC5  6.1,67.82 0 top
JP1  42.35,51.89 0 top
JP2  64.58,73.4 0 top
JP3  38.71,46.59 0 top
JP4  42.35,60.7 0 top
JP5  42.35,56.35 0 top
JP6  18,7 270 top
JP8  58,8 90 top
LED1  38,73 0 top
LED1GREEN  17.27,48.79 0 top
LED1GREEN1  34.36,52.44 180 top
LED1GREEN2  30.14,52.44 180 top
LED1GREEN3  25.91,52.44 180 top
LED1GREEN4  21.68,52.44 180 top
PAD3  35,16 0 top
PAD4  40,16 0 top
R1  13,66 90 top
R3  64.17,52.11 180 bottom
R4  54.15,52.13 0 bottom
R5  17.27,43.86 90 top
R6  34.36,57.33 270 top
R7  30.14,57.33 270 top
R8  25.91,57.33 270 top
R9  21.68,57.33 270 top
R10  49.41,33.45 90 top
R11  49.27,38.12 270 top
R12  26.35,38.23 270 top
R13  26.35,33.4 90 top
RESET  43.21,36.67 270 top
SW1  32.73,36.67 90 top
Y1  69.41,62.87 90 top

### Tracks (layer width: path | path; a pad name or v marks a point on that pad's centre or on a via)
5V  (via drill 0.35)
  Top 0.381: v45.21,9.87 42.81,12.27 42.81,12.8 41.2,14.4 39.07,14.4 v36.67,16.8 | v28.94,36.27 v32.94,40.27
  Top 0.4: IC2.3 29.54,22.02 v30.51,22.99
  Bottom 0.381: JP4.1 39.87,60.54 39.87,56.54 JP5.1 39.87,56.27 39.87,52.01 JP1.1 39.6,51.74 39.6,49.07 38.8,48.27 38.8,47.47 38.01,46.67 37.2,46.67 36.14,45.61 36.14,43.47 v32.94,40.27 | v45.21,9.87 45.21,6.13 C4.1 | v36.67,16.8 30.54,22.94 v30.51,22.99 | v28.94,36.27 28.94,24 C12.2
  Bottom 0.4: C12.2 29.5,24 v30.51,22.99 | C4.1 46.89,4.25 IC4.16
12V  (via drill 0.35)
  Top 0.381: D1.1 23.87,4.27 23.34,4.8 23.07,4.8 19.6,8.27 18.8,8.27 18,9.07 18,9.87 20.4,12.27 28.14,12.27 IC4.8 | 30.82,14.95 30.8,14.94 30.92,14.01 | D4.1 11.87,4.27 11.34,4.8 11.07,4.8 10.8,5.07 10.8,16 20.94,26.14 42.54,26.14 47.34,21.34 47.34,19.2 45.21,17.07 IC3.3 | v45.86,16.35 46.01,16.27 51.34,10.94 51.87,10.94 D5.1 52.14,10.94 52.94,11.73 59.87,11.73 60.67,10.94 63.88,10.94 D8.1 | 35.46,18.67 35.6,18.67 35.6,18.42
  Top 0.4: IC2.1 28.24,17.54 v26.18,17.54 | IC3.3 45.7,16.35 v45.86,16.35
  Top 0.7: 31.32,14.46 30.82,14.95 IC2.1 | 35.42,18.42 35.6,18.42 43.63,18.42 IC3.3
  Top 1.016: C7.1 35.46,18.67 35.46,16.46 PAD3.1
  Top 2: PAD3.1 33.01,14.01 30.92,14.01 29.17,12.25 IC4.8
  Bottom 0.4: C5.1 27.25,18.61 v26.18,17.54 | C10.2 46.08,16.13 v45.86,16.35
AN0  (via drill 0.35)
  Top 0.381: v56.94,42.94 57.21,43.2 57.21,49.87 61.21,53.87 61.21,55.21 IC1.19 | v56.67,29.6 54.27,27.2 v47.07,27.2 | v27.07,36.01 27.6,35.47 29.47,35.47 31.6,33.34 31.6,33.07 34.01,30.67 v43.61,30.67 43.61,32.54 v46.27,35.2
  Bottom 0.381: v56.94,42.94 58.54,41.34 58.54,37.34 56.67,35.47 v56.67,29.6 | v43.61,30.67 v47.07,27.2 | v27.07,36.01 27.07,37.34 25.74,38.67 25.74,44.27 24.94,45.07 JP3.3 | v46.27,35.2 46.27,49.61 44.94,50.94 44.94,51.74 JP1.3
AN1  (via drill 0.35)
  Top 0.381: v57.74,41.07 57.74,49.61 62.01,53.87 62.01,55.21 IC1.20 | v43.61,29.6 30.54,29.6 v27.87,32.27 | v38.54,54.41 38.54,57.61 39.6,58.67 42.81,58.67 44.67,60.54 JP4.3 44.94,60.54 45.74,59.74 46.54,59.74 47.34,60.54 47.34,62.94 46.01,64.28 v44.41,64.28
  Bottom 0.381: v57.74,41.07 57.74,40.27 55.07,37.6 55.07,28.8 55.61,28.27 55.61,20.27 55.07,19.74 53.47,19.74 v43.61,29.6 | v27.87,32.27 27.87,37.34 27.07,38.14 27.07,45.07 JP3.5 27.07,45.34 26,46.41 26,48.27 27.34,49.61 30,49.61 32.67,52.27 32.67,57.61 39.34,64.28 v44.41,64.28 | 32.4,45.34 32.4,46.14 33.74,47.47 33.74,49.61 v38.54,54.41
AN4  (via drill 0.35)
  Top 0.381: v64.94,46.14 64.94,54.14 65.21,54.41 65.21,57.07 IC1.23 | v59.34,36.27 58.01,36.27 51.34,29.6 v48.41,29.6 | v42.54,37.07 40.94,38.67 40.67,38.67 35.07,44.27 35.07,45.07 JP3.11 | v45.21,49.61 46.01,50.41 46.01,53.34 44.94,54.41 44.94,56.27 JP5.3
  Bottom 0.381: v64.94,46.14 64.94,44.27 59.61,38.94 59.61,36.54 v59.34,36.27 | v48.41,29.6 48.41,30.4 42.54,36.27 v42.54,37.07 43.87,38.41 43.87,48.27 v45.21,49.61
AN5  (via drill 0.35)
  Top 0.381: v63.88,57.87 65.21,57.87 IC1.24 | v47.61,28 v54.01,28 | v37.2,40.27 37.74,39.74 | 37.74,39.74 v41.74,35.74 | v9.75,61.38 9.75,63.9 | v13.75,44 v9.75,48 | v19.88,37.88 v17.25,40.5 | v21.5,38.38 24.62,41.5 29.12,41.5 v29.12,39.62 | 37.74,39.74 v36,38
  Top 0.4: IC5.10 7.9,67.13 7.05,66.28 C14.1 8.15,63.9 9.75,63.9 11.85,63.9 R1.1
  Bottom 0.381: v63.88,57.87 64.94,56.81 64.94,56.54 67.08,54.41 67.08,51.21 63.88,48.01 56.94,48.01 55.61,46.67 54.81,46.67 54.01,45.87 v54.01,28 | v47.61,28 47.61,29.87 v41.74,35.74 | v37.2,40.27 37.2,45.07 JP3.13 | v9.75,48 v9.75,61.38 | v17.25,40.5 v13.75,44 | v19.88,37.88 20.38,38.38 v21.5,38.38 | v29.12,39.62 30.75,38 v36,38
AN6  (via drill 0.35)
  Top 0.381: 40.12,27.2 45.74,27.2 47.34,28.8 51.61,28.8 v58.27,35.47 | 40.12,27.2 19.34,27.2 14,32.54 14,41.34 4.4,50.94 4.4,68.01 IC5.7 | v56.41,53.07 v56.41,46.41 | v63.34,58.67 65.21,58.67 IC1.25 | 40.12,27.2 v40.12,27
  Bottom 0.381: v58.27,35.47 58.27,36.27 59.07,37.07 59.07,43.74 v56.41,46.41 | v56.41,53.07 56.41,54.67 60.41,58.67 v63.34,58.67 | v40.12,27 38.88,28.25 38.88,36.25 36.38,38.75 32.62,38.75 31.62,39.75 29.88,39.75 29.88,45.25 JP3.7
AN7  (via drill 0.35)
  Top 0.381: 23.5,27.74 19.6,27.74 14.54,32.8 14.54,55.47 5.73,64.28 5.73,68.01 IC5.8 | 23.5,27.74 44.14,27.74 46.81,30.4 50.01,30.4 56.67,37.07 56.67,38.94 64.41,46.67 64.41,56.01 62.54,57.87 62.54,58.94 63.08,59.47 65.21,59.47 IC1.26 | v23.5,43.5 23.5,43.25 32.25,43.25 32.62,43.62 32.62,45 32.38,45.25 JP3.9 | v23.5,28 23.5,27.74
  Bottom 0.381: v23.5,28 v23.5,43.5
AVDD  (via drill 0.35)
  Top 0.4: IC1.17 v59.61,53.7
  Bottom 0.4: v59.61,53.7 60.16,53.16 C6.1 63.17,52.06 R3.1
AVSS  (via drill 0.35)
  Top 0.4: IC1.16 58.81,53.93 v58.6,53.72
  Bottom 0.4: v58.6,53.72 58.26,53.38 C6.2 58.19,52.13 R4.1
GND  (via drill 0.35)
  Top 0.381: v67.02,66.61 67.02,69.57 67.47,70.02 | 67.47,70.02 67.84,70.39 70.82,70.39 72.79,68.42 72.79,63.96 71.7,62.87 | 71.7,62.87 72.79,61.78 72.79,55.84 71.99,55.03 67.51,55.03 66.88,55.66 v66.88,60.74 66.81,60.81 66.81,61.34 66.28,61.87 65.47,61.87 IC1.29 | 71.7,62.87 Y1.3 | IC5.2 2,73.08 7.6,73.08 9.73,70.94 10.27,70.94 IC5.13 10.8,70.67 11.34,70.67 12.4,69.61 C13.2 12.94,69.88 9.2,66.14 9.2,65.08 C14.2 9.2,64.81 v11.34,64.81 | 35.07,32.27 v39.6,32.27 40.94,32.27 RESET.4 | 35.07,32.27 35.07,41.07 SW1.4 34.8,41.34 33.47,42.67 23.07,42.67 20.94,44.81 20.94,46.14 17.47,49.61 LED1GREEN.C 17.2,49.87 v17.2,51.21 | 35.07,32.27 SW1.2 | v40.94,43.2 40.94,41.34 RESET.2 | JP5.2 42.54,56.27 42.54,52.01 JP1.2 42.54,51.74 42.54,51.21 44.94,48.81 44.94,48.01 JP3.20 | v66.28,70.14 67.34,70.14 67.47,70.02 | 62.97,62.77 60.94,60.74 v60.94,59.74 | v63.81,62.17 63.61,62.41 63.47,62.27 62.97,62.77 | 62.97,62.77 59.61,66.14 59.61,66.67 IC1.39 | D3.2 12.13,10.94 20.94,19.74 IC2.2 21.2,20 29.2,20 34.8,25.6 38.8,25.6 40.41,24 C7.2 40.54,23.48 41.9,22.12 41.52,22.89 42.27,22.14 44.41,22.14 IC3.1 | v21.74,10.94 22,10.67 23.87,10.67 D2.2 | 39.74,4.4 39.34,4 IC4.13 | 39.74,4.4 40.14,4.8 47.34,4.8 47.87,4.27 51.87,4.27 D6.2 | 39.74,4.4 42.81,1.33 56.67,1.33 59.34,4 63.88,4 D7.2
  Top 0.4: v59.6,68.16 59.6,66.88 IC1.39 | IC1.29 64.11,61.87 v63.81,62.17 | IC1.6 52.37,61.07 v52.35,61.05 | Y1.3 68.38,62.87 v67.82,63.43 | IC5.2 1.9,73.27 | IC5.13 10.61,70.66
  Bottom 0.381: 68,70 68.62,70.62 72.79,70.62 72.79,60.01 | 72.79,60.01 72.79,55 69,55 68,56 | C8.2 69.39,65 v67.82,63.43 71.25,60 C9.2 71.34,60.01 72.79,60.01 | C2.2 61.56,70.99 59.99,69.45 59.99,68.54 v59.6,68.16 | v11.34,64.81 11.34,57.07 v17.2,51.21 | C1.1 50.54,61.61 46.54,61.61 45.47,62.67 44.41,62.67 42.54,60.81 JP4.2 42.54,60.54 42.54,56.54 JP5.2 | JP1.2 42.27,51.74 41.2,50.67 41.2,47.47 40.14,46.41 40.14,45.34 JP3.15 40.14,45.07 40.94,44.27 v40.94,43.2 40.94,40.54 41.74,39.74 41.74,36.8 40.94,36.01 40.94,32.27 | v66.28,70.14 68.14,72.01 68.14,73.34 JP2.6 | v60.94,59.74 60.67,59.74 53.21,52.27 R4.2 | v52.35,61.05 52.41,61.07 59.34,61.07 60.94,62.67 62.01,62.67 C3.2 | v21.74,10.94 21.74,10.4 19.6,8.27 18,8.27 16.94,7.2 JP6.3 17.2,7.2 18.54,5.87 19.87,5.87 26.27,12.27 26.27,14.94 30.14,18.8 | C12.1 27.07,23.74 28.94,21.87 28.94,20 C5.2 29.2,19.74 30.14,18.8 | 39.27,5.87 43.34,5.87 C4.2 | 40.54,18.14 47.87,18.14 C10.1 48.14,18.14 49.74,18.14 50.81,17.07 50.81,12.27 56.41,6.67 57.21,6.67 58.27,7.73 59.07,7.73 JP8.3 | 40.54,22.94 48.14,22.94 C11.2 | 30.14,18.8 36.14,12.8 IC4.5 | 40.94,32.27 40.94,24.8 C7.2 | 40.94,32.27 v39.6,32.27
  Bottom 0.4: C3.2 63.24,62.74 v63.81,62.17 | v52.35,61.05 51.22,61.05 C1.1
  Bottom 2: IC4.12 IC4.5 40.54,16.06 40.54,16.54 | IC4.13 39.27,5.87 IC4.4 40,12.98 PAD4.1 40.54,16.54 | C7.2 40.54,22.94 40.54,18.14 40.54,16.54
  pour Bottom: -18,43 -18,69 -4,83 94,83 101,76 101,-7 -11,-7 -15,-3 -18,0
INT0  (via drill 0.35)
  Top 0.381: v55.87,68.28 56.41,67.74 56.41,66.94 IC1.43 | v14,3.47 15.87,1.6 40.41,1.6 v40.94,2.13 | v55.87,37.34 54.01,39.2 54.01,45.61 52.94,46.67 52.94,47.74 JP3.26
  Bottom 0.381: v55.87,68.28 53.21,68.28 52.41,69.08 44.67,69.08 42.54,71.21 33.47,71.21 27.87,65.61 11.07,65.61 10.54,65.08 10.54,6.93 v14,3.47 | v40.94,2.13 42.54,2.13 44.14,3.73 IC4.15 44.41,3.73 45.47,2.67 55.61,2.67 58.01,5.07 58.01,5.87 58.81,6.67 59.61,6.67 60.41,7.47 60.41,24.27 55.87,28.8 v55.87,37.34
MCLR  (via drill 0.35)
  Top 0.381: v60.81,56.94 60.81,56.69 60.41,56.28 60.41,55.47 IC1.18 | JP2.8 73.48,73.34 73.48,55.74 71.61,53.87 v65.74,53.87 65.74,45.87 57.21,37.34 57.21,36.54 v52.67,32 | v22.27,33.6 27.07,28.8 44.41,28.8 47.87,32.27 49.21,32.27 R10.1 49.47,32.54 v51.07,32.54
  Bottom 0.381: v60.81,56.94 62.68,56.94 v65.74,53.87 | v22.27,33.6 22.27,45.07 JP3.1 | v52.67,32 51.61,32 v51.07,32.54
MOTORL+
  Top 0.381: D1.2 24.14,5.87 24.14,8.8 D2.1
  Top 0.4: D2.1 24,9.52
  Top 1.2: JP6.2 22.95,9.54 22.96,9.52 24,9.52 31.46,9.52 IC4.6
MOTORL-
  Top 0.381: 15.22,5.87 12.13,5.87 | 12.13,5.87 12.13,8.8 D3.1 | 12.13,5.87 D4.2
  Top 0.4: 16.22,9.03 JP6.1
  Top 1.2: IC4.3 39.1,9.54 33.39,9.54 28.96,5.11 28.55,5.11 26.17,2.72 16.32,2.72 15.22,3.83 15.22,5.87 15.22,7.63 16.73,9.14 JP6.1
MOTORR+
  Top 0.381: D6.1 52.14,6.13 52.14,6.67 52,7.2 52.14,7.73 52.14,9.07 D5.2
  Top 1.2: JP8.2 54.78,5.46 53.04,7.2 52,7.2 37.64,7.2 IC4.11
MOTORR-
  Top 0.381: D8.2 64.14,9.07 64.14,6.13 D7.1 63.88,5.87 59.87,5.87 JP8.1
  Top 0.4: 59.71,5.9 JP8.1
  Top 1.2: IC4.14 42.43,3.75 43.79,2.39 56.2,2.39 JP8.1
N$1
  Top 0.381: LED1GREEN.A 17.2,47.74 17.2,45.07 R5.2
N$2
  Top 0.381: LED1GREEN1.A 34.54,53.61 34.54,56.27 R6.2
N$3
  Top 0.381: LED1GREEN2.A 30.27,53.61 30.27,56.27 R7.2
N$6
  Top 0.381: LED1GREEN3.A 26,53.61 26,56.27 R8.2
N$7
  Top 0.381: SW1.1 30.27,32.27 28.94,32.27 27.07,34.14 26.54,34.14 R13.2 26.27,34.4 26.27,36.8 R12.2 26.54,37.34 27.87,37.34 30.27,39.74 30.27,41.07 SW1.3
  Top 0.4: 26.35,37 R12.2 | SW1.1 30.36,32
N$8
  Top 0.381: RESET.3 45.47,32.27 47.07,32.27 49.21,34.4 R10.2 49.47,34.4 49.47,37.07 R11.2 49.21,37.07 48.14,38.14 48.14,38.41 45.47,41.07 RESET.1
N$10
  Top 0.381: LED1GREEN4.A 21.74,53.61 21.74,56.27 R9.2
OSC1  (via drill 0.35)
  Top 0.381: 69.07,56.93 69.21,57.07 69.21,58.14 Y1.1
  Top 0.4: Y1.1 69.41,59.62 66.36,62.67 IC1.30 | v70.7,56.71 69.29,56.71 69.07,56.93 69,57
  Bottom 0.4: C9.1 70.7,57.51 v70.7,56.71
OSC2  (via drill 0.35)
  Top 0.381: 69.11,68.11 69.21,68.01 69.21,67.47 Y1.2
  Top 0.4: Y1.2 69.41,66.37 66.51,63.47 IC1.31 65,63.47 | v70.79,68.51 69.51,68.51 69.11,68.11 69,68
  Bottom 0.4: C8.1 70.79,67.4 v70.79,68.51
PGEC1  (via drill 0.35)
  Top 0.381: v59.34,65.34 59.34,60.27 63.61,56.01 63.61,55.47 IC1.22 | v60.14,71.21 60.94,71.21 63.08,73.34 JP2.4
  Bottom 0.381: v59.34,65.34 59.34,66.41 57.74,68.01 57.74,68.81 v60.14,71.21
PGEC2  (via drill 0.35)
  Top 0.381: v52.41,58.67 53.74,58.67 IC1.9 | v40.67,54.41 39.87,54.41 v38.27,52.81
  Bottom 0.381: v52.41,58.67 52.41,57.61 49.21,54.41 v40.67,54.41 | v38.27,52.81 38.27,48.81 37.47,48.01 JP3.14
PGEC3  (via drill 0.35)
  Top 0.381: v59.67,56.87 57.21,59.34 57.21,66.67 IC1.42 | v35.34,2.93 36.14,2.93 36.41,2.67 37.2,2.67 38.27,3.73 38.27,4.27 39.6,5.6 v50.54,5.6 | v53.47,10.94 v53.47,8.53 | v52.14,12.27 52.14,14.94 74.28,37.07 74.28,53.07 73.74,53.61 72.14,53.61 v66.54,48.01 | v62.81,46.14 63.61,46.94 v63.61,48.81
  Bottom 0.381: v59.67,56.87 60.67,57.87 62.81,57.87 66.54,54.14 66.54,51.47 63.74,48.67 | 63.74,48.67 63.61,48.54 55.87,48.54 55.34,48.01 JP3.28 | v35.34,2.93 35.34,5.33 31.87,8.8 31.87,12 IC4.7 | v53.47,8.53 v50.54,5.6 | v52.14,12.27 v53.47,10.94 | v66.54,48.01 65.47,48.01 63.61,46.14 v62.81,46.14 | v63.61,48.81 63.74,48.67
PGED1  (via drill 0.35)
  Top 0.381: v62.81,47.21 62.81,55.21 IC1.21
  Bottom 0.381: v62.81,47.21 63.88,47.21 67.61,50.94 67.61,54.67 65.47,56.81 65.47,62.41 63.61,64.28 63.61,68.54 65.74,70.67 65.74,73.34 JP2.5
PGED2  (via drill 0.35)
  Top 0.381: v55.34,61.87 55.34,60.27 54.54,59.47 54.01,59.47 IC1.8 | v46.54,62.67 45.74,63.48 40.14,63.48 37.47,60.81 37.47,50.41 39.87,48.01 JP3.16
  Bottom 0.381: v55.34,61.87 52.41,61.87 51.61,62.67 v46.54,62.67
PGED3  (via drill 0.35)
  Top 0.381: v27.87,38.41 27.34,38.94 26.54,38.94 R12.1 | v38.8,17.34 39.07,17.34 39.34,17.6 40.67,17.6 44.14,14.13 44.14,12.27 IC4.2 | v58.01,64.54 58.01,66.67 IC1.41 | v54.81,20.54 49.21,14.94 v48.41,14.94
  Bottom 0.381: 28.27,38.01 38.8,27.47 v38.8,17.34 | 28.27,38.01 v27.87,38.41 | v58.01,64.54 56.94,64.54 55.61,63.21 47.07,63.21 46.81,63.48 39.34,63.48 37.47,61.61 37.47,56.27 30.27,49.07 29.2,49.07 28.4,48.27 28.4,38.14 28.27,38.01 | v54.81,20.54 54.81,28.27 54.54,28.54 54.54,37.87 55.07,38.41 55.07,45.07 JP3.27 | v48.41,14.94 47.07,14.94 44.41,12.27 IC4.2
PWM1H1  (via drill 0.35)
  Top 0.381: LED1GREEN3.C 26,51.47 28.4,51.47 29.47,52.54 30.8,52.54 32.14,51.21 32.14,48.01 JP3.10 32.4,47.74 33.47,46.67 33.47,45.07 42.27,36.27 42.81,36.27 43.21,36.67 | v51.87,49.61 56.14,53.87 56.67,53.87 57.21,54.41 57.21,55.21 IC1.14 | v51.34,44.54 49.47,42.67 44.67,42.67 43.34,41.34 43.34,36.8 43.21,36.67 | v49.47,17.34 49.47,18.4 48.41,19.47 v48.41,26.4 | v43.34,36.54 43.21,36.67
  Bottom 0.381: v51.87,49.61 51.87,48.81 51.34,48.27 v51.34,44.54 | v49.47,17.34 49.47,14.67 47.07,12.27 IC4.1 | v48.41,26.4 48.41,28.54 49.21,29.34 49.21,30.67 v43.34,36.54
PWM1H2  (via drill 0.35)
  Top 0.381: v31.87,52.54 32.94,51.47 34.27,51.47 LED1GREEN1.C 34.54,51.47 v35.6,52.54 | v28.94,50.41 28.94,49.61 27.34,48.01 JP3.6 | v48.41,58.41 48.94,57.87 53.74,57.87 IC1.10 | v46.27,60.54 46.27,61.87 45.47,62.67 v40.67,62.67
  Bottom 0.381: v31.87,52.54 31.07,52.54 v28.94,50.41 23.07,50.41 19.07,46.41 19.07,16 15.07,12 15.07,4.53 16.94,2.67 19.87,2.67 20.94,3.73 28.94,3.73 IC4.9 | v46.27,60.54 v48.41,58.41 | v40.67,62.67 39.34,62.67 38.01,61.34 38.01,54.94 v35.6,52.54
PWM1L1  (via drill 0.35)
  Top 0.381: v31.87,44.01 31.07,44.81 31.07,45.87 30.27,46.67 26.8,46.67 26,47.47 26,48.27 23.07,51.21 21.74,51.21 LED1GREEN4.C | v36.41,49.07 38.01,49.07 38.8,48.27 38.8,47.21 39.34,46.67 48.14,46.67 48.94,47.47 48.94,48.27 51.07,50.41 51.07,52.27 55.34,56.54 57.47,56.54 58.01,56.01 58.01,55.47 IC1.15
  Bottom 0.381: v31.87,44.01 32.67,44.01 33.74,45.07 33.74,46.67 34.8,47.74 JP3.12 35.07,47.74 v36.41,49.07
PWM1L2  (via drill 0.35)
  Top 0.381: LED1GREEN2.C 30,51.21 30,48.01 JP3.8 | v50.27,50.67 50.27,52.27 53.74,55.74 53.74,56.96 53.81,56.96 IC1.11 | v50.81,49.07 51.34,48.54 51.34,47.47 50.54,46.67 49.74,46.67 48.94,45.87 48.94,45.07 47.07,43.2 44.41,43.2 42.01,40.8 42.01,40.01 41.47,39.47 v40.94,39.47
  Bottom 0.381: v50.27,50.67 50.27,49.61 v50.81,49.07 | v40.94,39.47 32.67,39.47 31.07,41.07 31.07,46.67 30,47.74 JP3.8
PWM2L1  (via drill 0.35)
  Top 0.381: v55.34,64.01 54.81,63.48 54.01,63.48 IC1.3 | v41.47,69.34 39.87,69.34 39.07,70.14 32.4,70.14 31.34,69.08 18,69.08 12.67,74.41 10.54,74.41 IC5.16
  Bottom 0.381: v55.34,64.01 46.81,64.01 v41.47,69.34
RP20  (via drill 0.35)
  Top 0.381: v64.41,68.01 61.48,68.01 61.21,67.74 61.21,66.94 IC1.37 | v73.48,52.81 60.14,39.47 60.14,23.74 v50.01,13.6 | v42.01,10.67 39.6,8.27 33.74,8.27 v30.27,4.8
  Bottom 0.381: v64.41,68.01 65.21,68.01 68.41,71.21 73.21,71.21 73.48,70.94 v73.48,52.81 | v50.01,13.6 47.07,10.67 v42.01,10.67 | v30.27,4.8 21.2,4.8 19.6,3.2 18,3.2 16.94,4.27 JP6.5
RP21  (via drill 0.35)
  Top 0.381: v19.87,28.54 15.6,32.8 15.6,55.47 19.6,59.47 34.54,59.47 39.6,64.54 42.81,64.54 48.41,70.14 64.41,70.14 66.01,68.54 66.01,66.89 65.53,66.41 65.21,66.41 64.41,65.61 60.94,65.61 60.41,66.14 60.41,66.67 IC1.38
  Bottom 0.381: v19.87,28.54 19.87,14.4 15.6,10.13 15.6,6.4 16.4,5.6 18,5.6 19.07,4.53 JP6.6
RP24  (via drill 0.35)
  Top 0.381: v52.14,68.28 56.14,64.28 56.14,63.74 55.07,62.67 54.01,62.67 IC1.4 | v60.67,6.67 60.67,9.07 59.34,10.4 JP8.5
  Bottom 0.381: v52.14,68.28 44.67,68.28 42.27,70.67 36.67,70.67 18,52.01 18,15.73 14.54,12.27 14.54,4.27 17.47,1.33 56.94,1.33 60.67,5.07 v60.67,6.67
RP25  (via drill 0.35)
  Top 0.381: v49.21,58.94 52.14,61.87 53.74,61.87 IC1.5 | v49.21,55.47 49.21,49.87 v48.41,49.07 | v49.74,22.14 v49.74,24.54
  Bottom 0.381: v49.21,55.47 v49.21,58.94 | v48.41,49.07 48.94,48.54 48.94,31.74 49.74,30.94 v49.74,24.54 | v49.74,22.14 49.74,20.27 56.67,13.34 56.67,10.67 JP8.6
SCL1  (via drill 0.35)
  Top 0.381: 55.61,66.67 55.61,65.61 56.67,64.54 56.67,60.81 v56.14,60.27 | v52.14,56.27 48.94,56.27 48.41,55.74 v48.41,50.14 | v25.2,16.27 v27.07,14.4 | v24.4,44.01 23.34,45.07 23.34,48.54 v21.74,50.14 | 55.61,66.67 v54.81,67.47 | 55.61,66.67 IC1.44
  Bottom 0.381: v52.14,56.27 v56.14,60.27 | v48.41,50.14 50.01,48.54 50.01,48.01 JP3.24 | v27.07,14.4 27.07,12.8 31.6,8.27 31.6,4 IC4.10 | v25.2,16.27 25.2,43.2 v24.4,44.01 | v21.74,50.14 21.74,54.94 36.94,70.14 42.01,70.14 44.67,67.47 v54.81,67.47
SDA1
  Top 0.381: IC1.1 53.74,65.08 52.94,65.08 47.61,59.74 47.61,48.01 JP3.22
SOSCI  (via drill 0.35)
  Top 0.381: v66.28,65.88 65.47,65.08 IC1.33 | v65.21,67.21 65.21,68.54 64.14,69.61 48.67,69.61 43.07,64.01 39.87,64.01 36.41,60.54 36.41,50.14 35.6,49.34 35.6,48.81 36.14,48.27 36.14,47.47 36.94,46.67 37.74,46.67 38.8,45.61 38.8,44.81 39.6,44.01 46.27,44.01 47.34,45.07 JP3.21
  Bottom 0.381: v66.28,65.88 65.21,66.94 v65.21,67.21
SOSCO  (via drill 0.35)
  Top 0.381: v64.41,66.67 63.61,66.67 IC1.34 | v57.47,33.34 52.94,28.8 v52.67,28.8
  Bottom 0.381: v64.41,66.67 64.41,64.28 66.01,62.67 66.01,57.07 68.14,54.94 68.14,46.67 60.14,38.67 60.14,36.01 v57.47,33.34 | v52.67,28.8 52.67,29.87 50.27,32.27 50.27,45.07 JP3.23
VCAP  (via drill 0.35)
  Top 0.4: IC1.7 52.74,60.27 v52.39,59.92
  Bottom 0.4: v52.39,59.92 52.09,59.63 C1.2
VDD  (via drill 0.35)
  Top 0.381: IC1.40 58.81,68.06 58.88,68.13 58.88,68.45 59.3,68.88 59.9,68.88 | R6.1 34.27,58.41 30.27,58.41 R7.1 30,58.41 26,58.41 R8.1 25.74,58.41 21.74,58.41 R9.1 21.47,58.41 21.2,58.67 v19.87,58.67 19.87,54.94 16.14,51.21 16.14,44.01 17.2,42.94 R5.1 17.47,42.67 17.47,41.34 25.34,33.47 | v19.87,60.27 13.2,66.94 R1.2 | 25.34,33.47 26.27,32.54 R13.1 | 25.34,33.47 v24.4,32.54 | v64.94,70.94 68.41,70.94 70.81,73.34 JP2.7 | R11.1 49.47,39.2 49.47,41.6 52.94,45.07 JP3.25 | v51.07,26.14 51.07,20 IC3.4 | v26.27,16.27 25.2,17.34 25.2,17.6 27.07,19.47 29.47,19.47 35.07,25.07 38.01,25.07 43.07,20 44.41,20 IC3.2 | 59.9,68.88 59.99,68.78 | 59.9,68.88 60.72,68.88 v60.85,68.74
  Top 0.4: IC1.28 65.24,60.9 v63.81,60.9 | IC5.14 10.52,71.95 C13.1 14.1,70.85 14.1,69.25 13,68.15 R1.2 | IC3.2 46.41,19.8 v46.47,19.73 | IC3.4 50.59,19.54 v49.39,19.54
  Bottom 0.381: v19.87,58.67 v19.87,60.27 | v24.4,32.54 24.4,15.47 | 24.4,15.47 24.4,12.27 19.34,7.2 JP6.4 | v63.81,60.9 63.88,61.07 64.67,61.87 64.67,62.42 62.78,64.32 62.5,64.6 C2.1 | JP8.4 56.67,8 56.67,8.8 51.34,14.13 51.34,17.6 49.47,19.47 v49.39,19.54 | 59.87,49.07 54.81,49.07 54.01,48.27 54.01,46.67 52.67,45.34 JP3.25 52.94,45.07 53.47,44.54 53.47,28.54 v51.07,26.14 | 59.87,49.07 62.28,49.07 64.41,51.21 64.41,51.47 64.94,52.01 R3.2 | 51.21,52.14 52.67,50.67 59.34,50.67 59.87,50.14 59.87,49.07 | 51.21,52.14 49.47,53.87 44.41,53.87 43.61,53.07 43.61,50.67 42.54,49.61 42.54,48.01 JP3.18 | 51.21,52.14 59.87,60.81 62.01,60.81 C3.1 | 24.4,15.47 25.47,15.47 v26.27,16.27 | v60.85,68.74 61.2,69.09 C2.1 | C2.1 64.35,70.94 v64.94,70.94
  Bottom 0.4: C3.1 63.75,60.84 v63.81,60.9 | v46.47,19.73 46.77,19.73 C11.1 48.17,20.77 v49.39,19.54